# Altium schematic sheet PWN_NEW.SchDoc
size A3; Organization: Altium Limited; Address1: L3, 12a Rodborough Rd; Address2: Frenchs Forest; Address3: NSW; Address4: Australia 2086
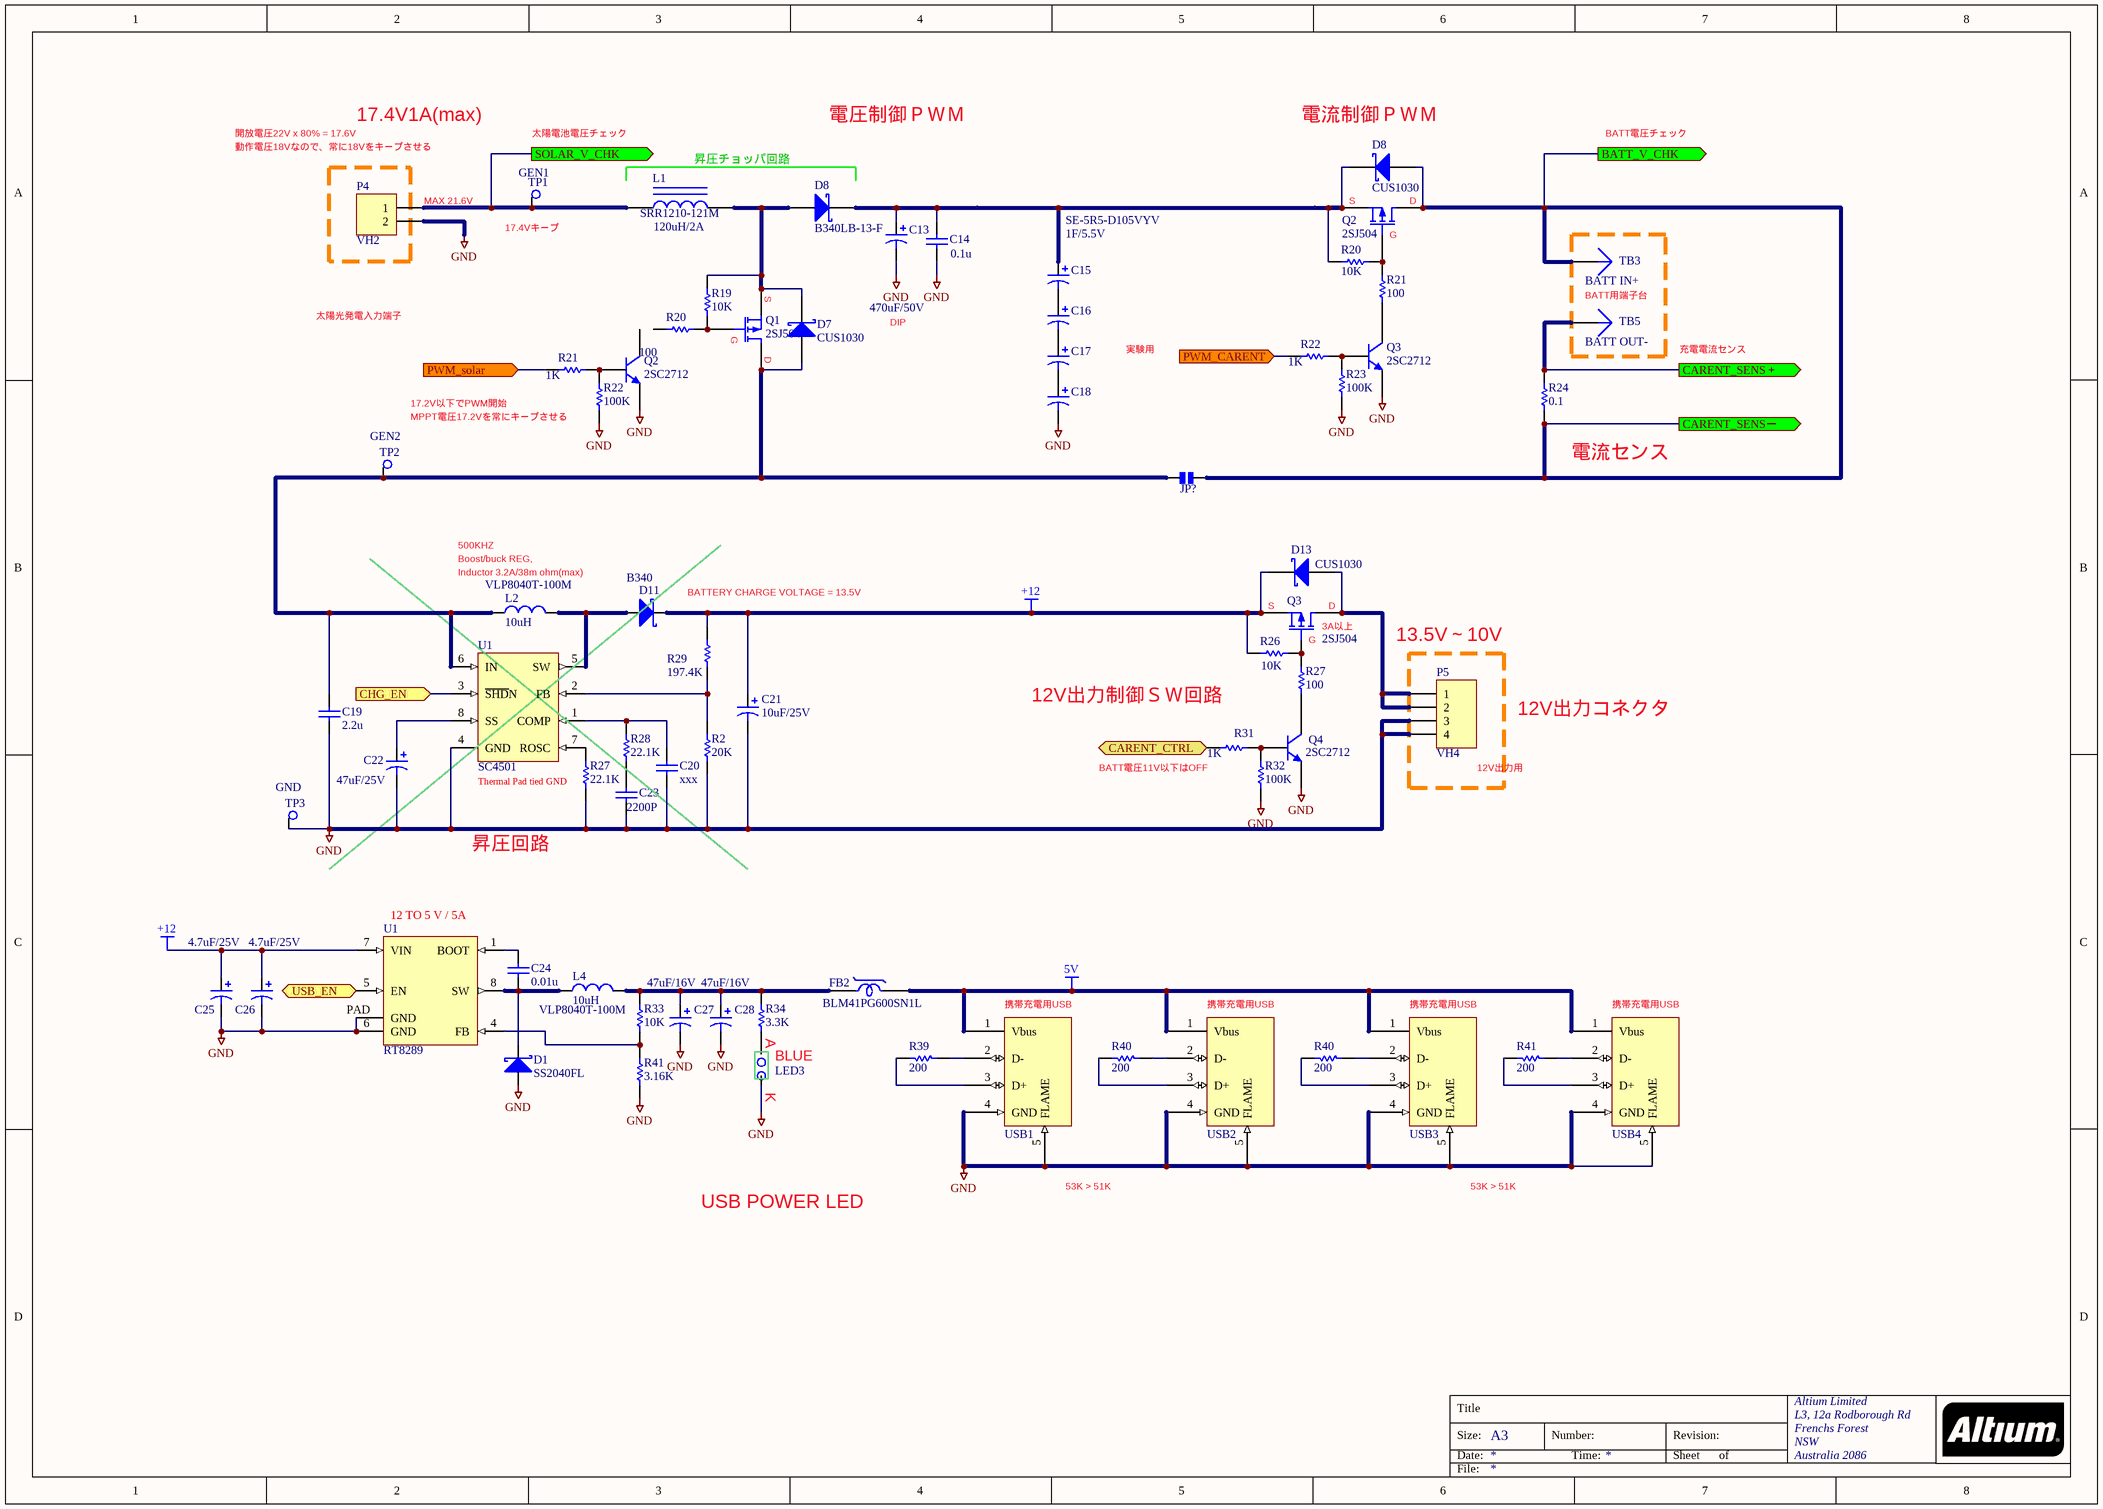
[diagram p0: PWN_NEW.SchDoc]

## Parts
(Parts that share a designator on the sheet are numbered #1, #2 ... from top to bottom, then left to right.)
C13  470uF/50V  [CAPPA14.05-10.5x6.3]
C14  0.1u  [CAPR2.54-5.1x3.2]
C15  SE-5R5-D105VYV  value 1F/5.5V  [CAPPA14.05-10.5x6.3]
C16  SE-5R5-D105VYV  [CAPPA14.05-10.5x6.3]  (value not drawn)
C17  SE-5R5-D105VYV  [CAPPA14.05-10.5x6.3]  (value not drawn)
C18  SE-5R5-D105VYV  [CAPPA14.05-10.5x6.3]  (value not drawn)
C19  2.2u  [CAPC1608L]
C20  xxx  [CAPC1608L]
C21  10uF/25V  [CAPC4532L]
C22  47uF/25V  [CAPC4532L]
C23  2200P  [CAPC1608L]
C24  0.01u  [CAPC1608L]
C25  4.7uF/25V  [CAPC4532L]
C26  4.7uF/25V  [CAPC4532L]
C27  47uF/16V  [CAPC4532L]
C28  47uF/16V  [CAPC4532L]
D1  SS2040FL
D7  CUS1030  [DSO-C2/X2.3]
D8#1  CUS1030  [DSO-C2/X2.3]
D8#2  B340LB-13-F  [DSO-C2/X2.3]
D11  B340
D13  CUS1030  [DSO-C2/X2.3]
FB2  value BLM41PG600SN1L  [INDC2012L]  (hidden comment: FERRITE BEADS1)
JP?  JP4  (value not drawn)
L1  SRR1210-121M  value 120uH/2A  [AXIAL-0.9]
L2  10uH  PARTS: VLP8040T-100M
L4  10uH  PARTS: VLP8040T-100M
LED3  JP1  (value not drawn)
P4  VH2  [HDR1X2]
P5  VH4  [HDR1X4]
Q1  2SJ504  [BCY-W3/B.8]
Q2#1  2SJ504  [BCY-W3/B.8]
Q2#2  2SC2712  [BCY-W3]
Q3#1  2SC2712  [BCY-W3]
Q3#2  2SJ504  [BCY-W3/B.8]
Q4  2SC2712  [BCY-W3]
R2  20K  [AXIAL-0.3]
R19  10K  [AXIAL-0.3]
R20#1  10K  [AXIAL-0.3]
R20#2  100  [AXIAL-0.3]
R21#1  100  [AXIAL-0.3]
R21#2  1K  [AXIAL-0.3]
R22#1  1K  [AXIAL-0.3]
R22#2  100K  [AXIAL-0.3]
R23  100K  [AXIAL-0.3]
R24  0.1  [AXIAL-0.3]
R26  10K  [AXIAL-0.3]
R27#1  100  [AXIAL-0.3]
R27#2  22.1K  [AXIAL-0.3]
R28  22.1K  [AXIAL-0.3]
R29  197.4K  [AXIAL-0.3]
R31  1K  [AXIAL-0.3]
R32  100K  [AXIAL-0.3]
R33  10K  [AXIAL-0.3]
R34  3.3K  [AXIAL-0.3]
R39  200  [RESC1608L]
R40#1  200  [RESC1608L]
R40#2  200  [RESC1608L]
R41#1  200  [RESC1608L]
R41#2  3.16K  [AXIAL-0.3]
TB3  BATT IN+  [PIN1]
TB5  BATT OUT-  [PIN1]
TP1  GEN1
TP2  GEN2
TP3  GND
U1#1  SC4501
U1#2  RT8289
USB1  USB002  (value not drawn)
USB2  USB002  (value not drawn)
USB3  USB002  (value not drawn)
USB4  USB002  (value not drawn)

## Blocks framed on the sheet
BATT用端子台: TB3 TB5
12V出力用: P5

## Ports
BATT_V_CHK (out), CARENT_CTRL (in), CARENT_SENSー (out), CARENT_SENS＋ (out), CHG_EN (in), PWM_CARENT (in), PWM_solar (in), SOLAR_V_CHK (out), USB_EN (in)

## Nets
5V: FB2.2 USB1.1(Vbus) USB2.1(Vbus) USB3.1(Vbus) USB4.1(Vbus)
+12: C21.1 C25.1 C26.1 D11.2(K) D13.2(K) Q3#2.3(S) R26.2 R29.2 U1#2.7(VIN)
GND: C13.2 C14.1 C18.2 C19.2 C20.2 C21.2 C22.2 C23.2 C25.2 C26.2 C27.2 C28.2 D1.1(A) LED3.2 P4.2 P5.3 P5.4 Q2#2.2(E) Q3#1.2(E) Q4.2(E) R2.1 R22#2.1 R23.1 R27#2.1 R32.1 R41#2.1 TP3.1 U1#1.4(GND) U1#2.6(GND) U1#2.PAD(GND) USB1.4(GND) USB1.5(FLAME) USB2.4(GND) USB2.5(FLAME) USB3.4(GND) USB3.5(FLAME) USB4.4(GND) USB4.5(FLAME)
BATT_V_CHK: D8#1.1(A) JP?.2 Q2#1.2(D) R24.1 TB3.1 ; port BATT_V_CHK, port CARENT_SENSー
CARENT_CTRL: R31.1 ; port CARENT_CTRL
CARENT_SENS＋: R24.2 TB5.1 ; port CARENT_SENS＋
CHG_EN: U1#1.3(~{SHD}N) ; port CHG_EN
PWM_CARENT: R22#1.1 ; port PWM_CARENT
PWM_solar: R21#2.1 ; port PWM_solar
SOLAR_V_CHK: L1.1 P4.1 TP1.1 ; port SOLAR_V_CHK
USB_EN: U1#2.5(EN) ; port USB_EN
NetC13_1: C13.1 C14.2 C15.1 D8#1.2(K) D8#2.2(K) Q2#1.3(S) R20#1.2
NetC15_2: C15.2 C16.1
NetC16_2: C16.2 C17.1
NetC17_2: C17.2 C18.1
NetC19_1: C19.1 D7.1(A) JP?.1 L2.1 Q1.2(D) TP2.1 U1#1.6(IN)
NetC20_1: C20.1 R28.2 U1#1.1(COMP)
NetC22_1: C22.1 U1#1.8(SS)
NetC23_1: C23.1 R28.1
NetC24_1: C24.1 U1#2.1(BOOT)
NetC24_2: C24.2 D1.2(K) L4.1 U1#2.8(SW)
NetC27_1: C27.1 C28.1 FB2.1 L4.2 R33.2 R34.1
NetD7_2: D7.2(K) D8#2.1(A) L1.2 Q1.3(S) R19.2
NetD11_1: D11.1(A) L2.2 U1#1.5(SW)
NetD13_1: D13.1(A) P5.1 P5.2 Q3#2.2(D)
NetLED3_1: LED3.1 R34.2
NetQ1_1: Q1.1(G) R19.1 R20#2.2
NetQ2#1_1: Q2#1.1(G) R20#1.1 R21#1.2
NetQ2#2_1: Q2#2.1(B) R21#2.2 R22#2.2
NetQ3#1_1: Q3#1.1(B) R22#1.2 R23.2
NetQ3#1_3: Q3#1.3(C) R21#1.1
NetQ3#2_1: Q3#2.1(G) R26.1 R27#1.1
NetQ4_1: Q4.1(B) R31.2 R32.2
NetQ4_3: Q4.3(C) R27#1.2
NetR2_2: R2.2 R29.1 U1#1.2(FB)
NetR27#2_2: R27#2.2 U1#1.7(ROSC)
NetR33_1: R33.1 R41#2.2 U1#2.4(FB)
NetR39_1: R39.1 USB1.2(D-)
NetR39_2: R39.2 USB1.3(D+)
NetR40#1_1: R40#1.1 USB2.2(D-)
NetR40#1_2: R40#1.2 USB2.3(D+)
NetR40#2_1: R40#2.1 USB3.2(D-)
NetR40#2_2: R40#2.2 USB3.3(D+)
NetR41#1_1: R41#1.1 USB4.2(D-)
NetR41#1_2: R41#1.2 USB4.3(D+)

Not connected (* = marked no-connect by the designer): Q2#2 3(C); R20#2 1; U1#2 2(NC) 3(NC)

## Notes on the sheet
- 開放電圧22V x 80% = 17.6V
- 動作電圧18Vなので、常に18Vをキープさせる
- 17.4V1A(max)
- 太陽電池電圧チェック
- (near L1) 昇圧チョッパ回路
- 電圧制御ＰＷＭ
- (near D8#1) 電流制御ＰＷＭ
- BATT電圧チェック
- (near P4) MAX 21.6V
- (near TP1) 17.4Vキープ
- (near Q2#1) S
- (near Q2#1) G
- (near Q2#1) D
- 太陽光発電入力端子
- (near Q1) S
- (near Q1) G
- (near Q1) D
- DIP
- 実験用
- 充電電流センス
- 17.2V以下でPWM開始
- MPPT電圧17.2Vを常にキープさせる
- (near R24) 電流センス
- (near L2) Inductor 3.2A/38m ohm(max)
- (near L2) Boost/buck REG,
- 500KHZ
- BATTERY CHARGE VOLTAGE = 13.5V
- (near Q3#2) S
- (near Q3#2) G
- (near Q3#2) 3A以上
- (near Q3#2) D
- (near P5) 13.5V～10V
- 12V出力制御ＳＷ回路
- 12V出力コネクタ
- (near R27#2) Thermal Pad tied GND
- (near R31) BATT電圧11V以下はOFF
- 昇圧回路
- (near U1#2) 12 TO 5 V / 5A
- A
- (near USB1) 携帯充電用USB
- (near USB2) 携帯充電用USB
- (near USB3) 携帯充電用USB
- (near USB4) 携帯充電用USB
- (near LED3) K
- BLUE
- 53K > 51K
- USB POWER LED
- Title
- Size:
- Date:
- A3
- Number:
- Time:
- Revision:
- Sheet
- of
- File:

## Library data of the parts
C13 C15 = Cap Pol2: Polarized Capacitor (Axial); Published: 8-Jun-2000; LatestRevisionDate: 17-Jul-2002; LatestRevisionNote: Re-released for DXP Platform.; PackageReference: POLAR0.8; Publisher: Altium Limited
  C13: Value: 470uF/50V
C14 = Cap: Capacitor; Published: 8-Jun-2000; LatestRevisionDate: 17-Jul-2002; LatestRevisionNote: Re-released for DXP Platform.; PackageReference: RAD-0.3; Publisher: Altium Limited; Value: 0.1u
C16-C18 = Cap Pol2: Polarized Capacitor (Axial); Value: 1F/5.5V; Published: 8-Jun-2000; LatestRevisionDate: 17-Jul-2002; LatestRevisionNote: Re-released for DXP Platform.; PackageReference: POLAR0.8; Publisher: Altium Limited
C19 C20 C23 C24 = Cap Semi: Capacitor (Semiconductor SIM Model); Published: 8-Jun-2000; LatestRevisionDate: 29-May-2009; LatestRevisionNote: IPC-7351 Footprint Added.; PackageReference: C1206; Publisher: Altium Limited; PackageDescription: Chip Capacitor
  C19: Value: 2.2u
  C20: Value: xxx
  C23: Value: 2200P
  C24: Value: 0.01u
C21 C22 C25-C28 = Cap Pol3: Polarized Capacitor (Surface Mount); Published: 8-Jun-2000; LatestRevisionDate: 29-May-2009; LatestRevisionNote: IPC-7351 Footprint Added.; PackageReference: C0805; Publisher: Altium Limited; PackageDescription: Chip Capacitor
  C21: Value: 10uF/25V
  C22: Value: 47uF/25V
  C25 C26: Value: 4.7uF/25V
  C27 C28: Value: 47uF/16V
D1 D11 = DIODE SCHOTTKY1
D7 D8#1 D8#2 D13 = D Schottky: Schottky Diode; Published: 8-Jun-2000; LatestRevisionDate: 17-Jul-2002; LatestRevisionNote: Re-released for DXP Platform.; PackageReference: SMB; Publisher: Altium Limited; Code_JEDEC: DO-214-AA
L1 = Inductor Iron: Magnetic-Core Inductor; Published: 24-Mar-1999; LatestRevisionDate: 17-Jul-2002; LatestRevisionNote: Re-released for DXP Platform.; PackageReference: AXIAL-0.9; Publisher: Altium Limited
L2 L4 = INDUCTOR001
P4 = Header 2: Header, 2-Pin; LatestRevisionDate: 17-Jul-2002; LatestRevisionNote: Re-released for DXP Platform.; Publisher: Altium Limited
P5 = Header 4: Header, 4-Pin; LatestRevisionDate: 17-Jul-2002; LatestRevisionNote: Re-released for DXP Platform.; Publisher: Altium Limited
Q1 Q2#1 Q3#2 = MOSFET-P: P-Channel MOSFET; Published: 8-Jun-2000; LatestRevisionDate: 17-Jul-2002; LatestRevisionNote: Re-released for DXP Platform.; PackageVersion: 1995/1996; PackageReference: E3; Publisher: Altium Limited
Q2#2 Q3#1 Q4 = NPN: NPN Bipolar Transistor; Published: 8-Jun-2000; LatestRevisionDate: 17-Jul-2002; LatestRevisionNote: Re-released for DXP Platform.; PackageReference: TO-226; Publisher: Altium Limited; Code_JEDEC: TO-226-AA
R2 R19 R20#1 R20#2 R21#1 R21#2 R22#1 R22#2 R23 R24 R26 R27#1 R27#2 R28 R29 R31-R34 R41#2 = Res1: Resistor; PARTS: AH-50W 10R; PRICE: 350; LatestRevisionDate: 17-Jul-2002; LatestRevisionNote: Re-released for DXP Platform.; PackageReference: AXIAL-0.3
  R2: Value: 20K
  R19 R20#1 R26 R33: Value: 10K
  R20#2 R21#1 R27#1: Value: 100
  R21#2 R22#1 R31: Value: 1K
  R22#2 R23 R32: Value: 100K
  R24: Value: 0.1
  R27#2 R28: Value: 22.1K
  R29: Value: 197.4K
  R34: Value: 3.3K
  R41#2: Value: 3.16K
R39 R40#1 R40#2 R41#1 = Res Semi: Semiconductor Resistor; Published: 8-Jun-2000; LatestRevisionDate: 17-Jul-2002; LatestRevisionNote: Re-released for DXP Platform.; PackageReference: AXIAL-0.5; Publisher: Altium Limited; Value: 200
TB3 TB5 = Plug: LatestRevisionDate: 17-Jul-2002; LatestRevisionNote: Re-released for DXP Platform.; Publisher: Altium Limited
TP1-TP3 = RAUND1